# Altium schematic sheet Z7_POWER2.SchDoc
size A3
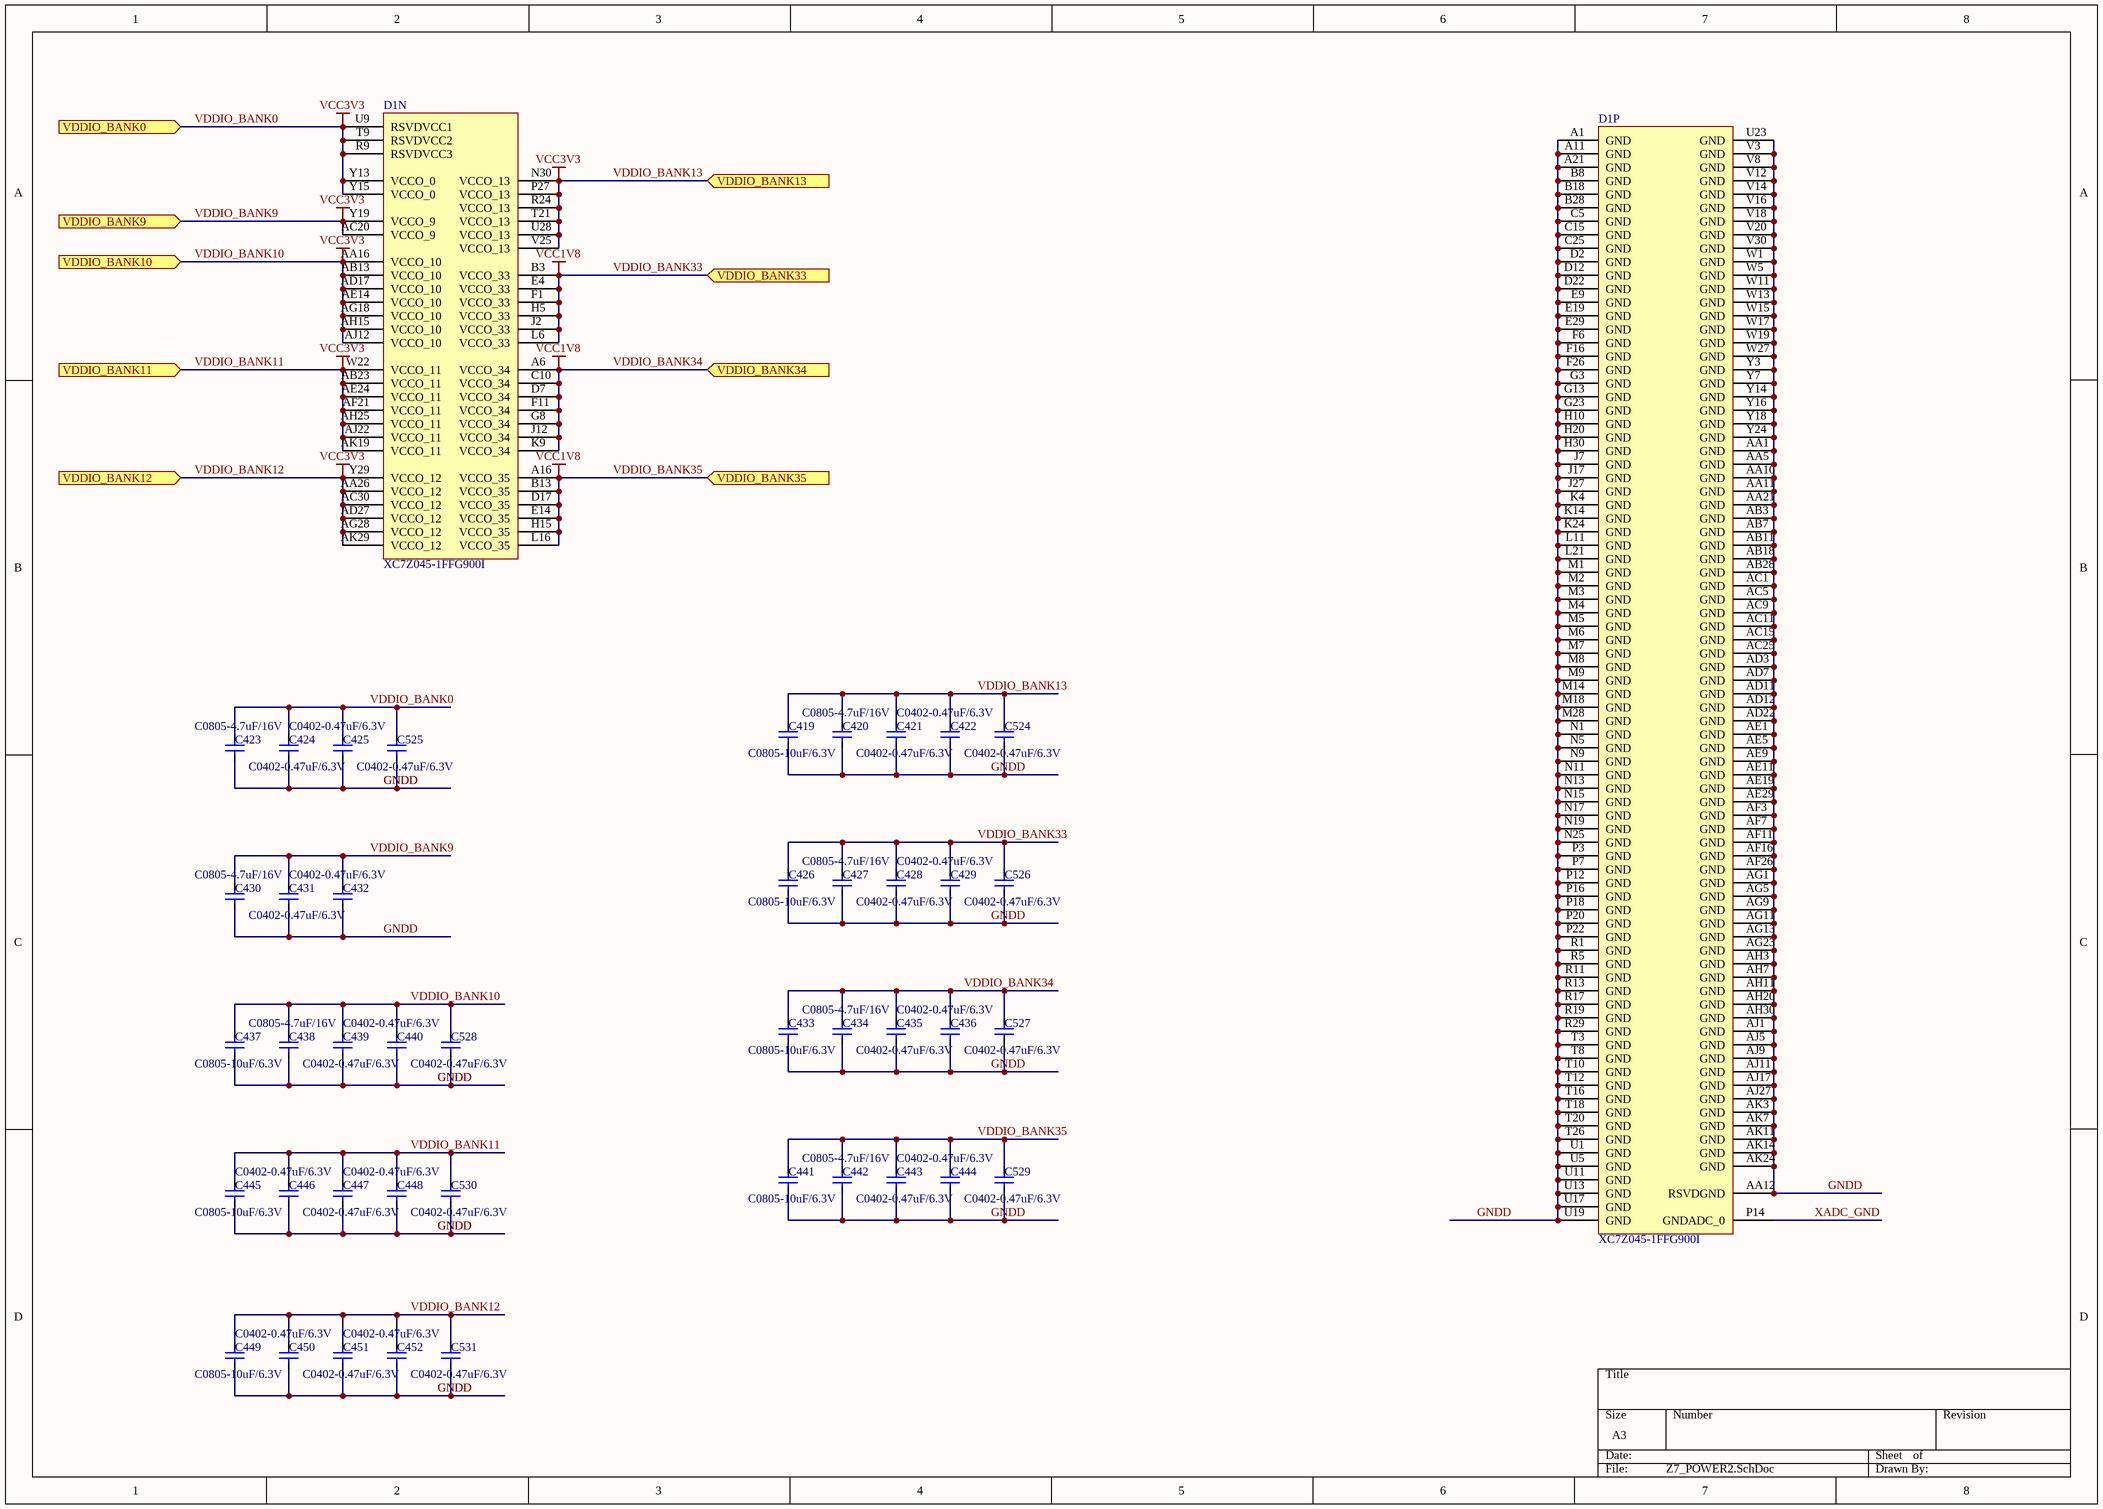
[diagram p0: Z7_POWER2.SchDoc]

## Parts
C419  C0805-10uF/6.3V  [C0805]
C420  C0805-4.7uF/16V  [C0805]
C421  C0402-0.47uF/6.3V  [C0402]
C422  C0402-0.47uF/6.3V  [C0402]
C423  C0805-4.7uF/16V  [C0805]
C424  C0402-0.47uF/6.3V  [C0402]
C425  C0402-0.47uF/6.3V  [C0402]
C426  C0805-10uF/6.3V  [C0805]
C427  C0805-4.7uF/16V  [C0805]
C428  C0402-0.47uF/6.3V  [C0402]
C429  C0402-0.47uF/6.3V  [C0402]
C430  C0805-4.7uF/16V  [C0805]
C431  C0402-0.47uF/6.3V  [C0402]
C432  C0402-0.47uF/6.3V  [C0402]
C433  C0805-10uF/6.3V  [C0805]
C434  C0805-4.7uF/16V  [C0805]
C435  C0402-0.47uF/6.3V  [C0402]
C436  C0402-0.47uF/6.3V  [C0402]
C437  C0805-10uF/6.3V  [C0805]
C438  C0805-4.7uF/16V  [C0805]
C439  C0402-0.47uF/6.3V  [C0402]
C440  C0402-0.47uF/6.3V  [C0402]
C441  C0805-10uF/6.3V  [C0805]
C442  C0805-4.7uF/16V  [C0805]
C443  C0402-0.47uF/6.3V  [C0402]
C444  C0402-0.47uF/6.3V  [C0402]
C445  C0805-10uF/6.3V  [C0805]
C446  C0402-0.47uF/6.3V  [C0402]
C447  C0402-0.47uF/6.3V  [C0402]
C448  C0402-0.47uF/6.3V  [C0402]
C449  C0805-10uF/6.3V  [C0805]
C450  C0402-0.47uF/6.3V  [C0402]
C451  C0402-0.47uF/6.3V  [C0402]
C452  C0402-0.47uF/6.3V  [C0402]
C524  C0402-0.47uF/6.3V  [C0402]
C525  C0402-0.47uF/6.3V  [C0402]
C526  C0402-0.47uF/6.3V  [C0402]
C527  C0402-0.47uF/6.3V  [C0402]
C528  C0402-0.47uF/6.3V  [C0402]
C529  C0402-0.47uF/6.3V  [C0402]
C530  C0402-0.47uF/6.3V  [C0402]
C531  C0402-0.47uF/6.3V  [C0402]
D1  XC7Z045-1FFG900I  [FFG900]  (parts N,P of 16)

## Ports
VDDIO_BANK0 (in), VDDIO_BANK9 (in), VDDIO_BANK10 (in), VDDIO_BANK11 (in), VDDIO_BANK12 (in), VDDIO_BANK13 (in), VDDIO_BANK33 (in), VDDIO_BANK34 (in), VDDIO_BANK35 (in)

## Nets
VDDIO_BANK0: C419.1 C420.1 C421.1 C422.1 C423.1 C424.1 C425.1 C430.1 C431.1 C432.1 C437.1 C438.1 C439.1 C440.1 C445.1 C446.1 C447.1 C448.1 C449.1 C450.1 C451.1 C452.1 C524.1 C525.1 C528.1 C530.1 C531.1 D1.AA16(VCCO_10) D1.AA26(VCCO_12) D1.AB13(VCCO_10) D1.AB23(VCCO_11) D1.AC20(VCCO_9) D1.AC30(VCCO_12) D1.AD17(VCCO_10) D1.AD27(VCCO_12) D1.AE14(VCCO_10) D1.AE24(VCCO_11) D1.AF21(VCCO_11) D1.AG18(VCCO_10) D1.AG28(VCCO_12) D1.AH15(VCCO_10) D1.AH25(VCCO_11) D1.AJ12(VCCO_10) D1.AJ22(VCCO_11) D1.AK19(VCCO_11) D1.AK29(VCCO_12) D1.N30(VCCO_13) D1.P27(VCCO_13) D1.R9(RSVDVCC3) D1.R24(VCCO_13) D1.T9(RSVDVCC2) D1.T21(VCCO_13) D1.U9(RSVDVCC1) D1.U28(VCCO_13) D1.V25(VCCO_13) D1.W22(VCCO_11) D1.Y13(VCCO_0) D1.Y15(VCCO_0) D1.Y19(VCCO_9) D1.Y29(VCCO_12) ; port VDDIO_BANK0, port VDDIO_BANK9, port VDDIO_BANK10, port VDDIO_BANK11, port VDDIO_BANK13, port VDDIO_BANK12  [also labelled VCC3V3, VDDIO_BANK10, VDDIO_BANK11, VDDIO_BANK12, VDDIO_BANK13, VDDIO_BANK9]
VDDIO_BANK33: C426.1 C427.1 C428.1 C429.1 C433.1 C434.1 C435.1 C436.1 C441.1 C442.1 C443.1 C444.1 C526.1 C527.1 C529.1 D1.A6(VCCO_34) D1.A16(VCCO_35) D1.B3(VCCO_33) D1.B13(VCCO_35) D1.C10(VCCO_34) D1.D7(VCCO_34) D1.D17(VCCO_35) D1.E4(VCCO_33) D1.E14(VCCO_35) D1.F1(VCCO_33) D1.F11(VCCO_34) D1.G8(VCCO_34) D1.H5(VCCO_33) D1.H15(VCCO_35) D1.J2(VCCO_33) D1.J12(VCCO_34) D1.K9(VCCO_34) D1.L6(VCCO_33) D1.L16(VCCO_35) ; port VDDIO_BANK33, port VDDIO_BANK34, port VDDIO_BANK35  [also labelled VCC1V8, VDDIO_BANK34, VDDIO_BANK35]
GNDD: C419.2 C420.2 C421.2 C422.2 C423.2 C424.2 C425.2 C426.2 C427.2 C428.2 C429.2 C430.2 C431.2 C432.2 C433.2 C434.2 C435.2 C436.2 C437.2 C438.2 C439.2 C440.2 C441.2 C442.2 C443.2 C444.2 C445.2 C446.2 C447.2 C448.2 C449.2 C450.2 C451.2 C452.2 C524.2 C525.2 C526.2 C527.2 C528.2 C529.2 C530.2 C531.2 D1.A1(GND) D1.A11(GND) D1.A21(GND) D1.AA1(GND) D1.AA5(GND) D1.AA10(GND) D1.AA11(GND) D1.AA12(RSVDGND) D1.AA21(GND) D1.AB3(GND) D1.AB7(GND) D1.AB11(GND) D1.AB18(GND) D1.AB28(GND) D1.AC1(GND) D1.AC5(GND) D1.AC9(GND) D1.AC11(GND) D1.AC15(GND) D1.AC25(GND) D1.AD3(GND) D1.AD7(GND) D1.AD11(GND) D1.AD12(GND) D1.AD22(GND) D1.AE1(GND) D1.AE5(GND) D1.AE9(GND) D1.AE11(GND) D1.AE19(GND) D1.AE29(GND) D1.AF3(GND) D1.AF7(GND) D1.AF11(GND) D1.AF16(GND) D1.AF26(GND) D1.AG1(GND) D1.AG5(GND) D1.AG9(GND) D1.AG11(GND) D1.AG13(GND) D1.AG23(GND) D1.AH3(GND) D1.AH7(GND) D1.AH11(GND) D1.AH20(GND) D1.AH30(GND) D1.AJ1(GND) D1.AJ5(GND) D1.AJ9(GND) D1.AJ11(GND) D1.AJ17(GND) D1.AJ27(GND) D1.AK3(GND) D1.AK7(GND) D1.AK11(GND) D1.AK14(GND) D1.AK24(GND) D1.B8(GND) D1.B18(GND) D1.B28(GND) D1.C5(GND) D1.C15(GND) D1.C25(GND) D1.D2(GND) D1.D12(GND) D1.D22(GND) D1.E9(GND) D1.E19(GND) D1.E29(GND) D1.F6(GND) D1.F16(GND) D1.F26(GND) D1.G3(GND) D1.G13(GND) D1.G23(GND) D1.H10(GND) D1.H20(GND) D1.H30(GND) D1.J7(GND) D1.J17(GND) D1.J27(GND) D1.K4(GND) D1.K14(GND) D1.K24(GND) D1.L11(GND) D1.L21(GND) D1.M1(GND) D1.M2(GND) D1.M3(GND) D1.M4(GND) D1.M5(GND) D1.M6(GND) D1.M7(GND) D1.M8(GND) D1.M9(GND) D1.M14(GND) D1.M18(GND) D1.M28(GND) D1.N1(GND) D1.N5(GND) D1.N9(GND) D1.N11(GND) D1.N13(GND) D1.N15(GND) D1.N17(GND) D1.N19(GND) D1.N25(GND) D1.P3(GND) D1.P7(GND) D1.P12(GND) D1.P16(GND) D1.P18(GND) D1.P20(GND) D1.P22(GND) D1.R1(GND) D1.R5(GND) D1.R11(GND) D1.R13(GND) D1.R17(GND) D1.R19(GND) D1.R29(GND) D1.T3(GND) D1.T8(GND) D1.T10(GND) D1.T12(GND) D1.T16(GND) D1.T18(GND) D1.T20(GND) D1.T26(GND) D1.U1(GND) D1.U5(GND) D1.U11(GND) D1.U13(GND) D1.U17(GND) D1.U19(GND) D1.U23(GND) D1.V3(GND) D1.V8(GND) D1.V12(GND) D1.V14(GND) D1.V16(GND) D1.V18(GND) D1.V20(GND) D1.V30(GND) D1.W1(GND) D1.W5(GND) D1.W11(GND) D1.W13(GND) D1.W15(GND) D1.W17(GND) D1.W19(GND) D1.W27(GND) D1.Y3(GND) D1.Y7(GND) D1.Y14(GND) D1.Y16(GND) D1.Y18(GND) D1.Y24(GND)
XADC_GND: D1.P14(GNDADC_0)

## Library data of the parts
C419 C426 C433 C437 C441 C445 C449 = C1210-22uF/16V: Part_number: C0805-10uF/6.3V; Part_type: CAP; Value: C0805-10uF/6.3V; Schematic_Part: CAP; PCB_Footprint: C0805
C420 C423 C427 C430 C434 C438 C442 = C0805-4.7uF/50V: X7R; Manufacturer: SAMSUNG; Part_number: C0805-4.7uF/16V; Part_type: CAP; Value: C0805-4.7uF/16V; Schematic_Part: CAP; PCB_Footprint: C0805; datasheet: #DataSheet\C_Samsung_General Capacitors.pdf#
C421 C422 C424 C425 C428 C429 C431 C432 C435 C436 C439 C440 C443 C444 C446-C448 C450-C452 C524-C531 = C0402-0.1uF/16V: X7R; Manufacturer: SAMSUNG; Manufacturer_p/n: CL05X7R104KO5NNN; Part_number: C0402-0.47uF/6.3V; Part_type: CAP; Value: C0402-0.47uF/6.3V; temperature: -55℃\+125℃; Schematic_Part: CAP; PCB_Footprint: C0402; datasheet: #DataSheet\C_Samsung_General Capacitors.pdf#
D1 = XC7Z045-1FFG900I: 667 MHz Zynq?7000 AP SoC, 130 PS I/O, 378 FPGA I/O, 900-Ball BGA, Speed Grade 1, Industrial Grade, Pb-Free; Manufacturer: Xilinx; Extensible Block RAM (# 36Kb Blocks): 2180 KB (545); Flip Flops: 437200; LUTs: 218600; Speed Grade: -1; DatasheetVersion: v1.2; PackageVersion: Rev 1.1; PackageReference: FFG900; PackageDescription: Flip-Chip BGA, Body 31 x 31 mm, 1.0 mm Pitch; Generic Part Number: XC7Z045; RoHS: Pb-Free; Mounting Technology: Surface Mount; Code_JEDEC: MS-034-AAN-1; PartNumber: XC7Z045-1FFG900I; ComponentLink1Description: Datasheet; ComponentLink1URL: http://www.xilinx.com/support/documentation/data_sheets/ds190-Zynq-7000-Overview.pdf; ComponentLink2Description: Package Specification; ComponentLink2URL: http://www.xilinx.com/support/documentation/user_guides/ug865-Zynq-7000-Pkg-Pinout.pdf; ComponentLink3Description: DC and AC Switching Characteristics; ComponentLink3URL: http://www.xilinx.com/support/documentation/data_sheets/ds191-XC7Z030-XC7Z045-data-sheet.pdf; ComponentLink4Description: Package File; ComponentLink4URL: http://www.xilinx.com/support/packagefiles/z7packages/xc7z045ffg900pkg.txt; ComponentLink5Description: Packaging and Pinout; ComponentLink5URL: http://www.xilinx.com/support/documentation/user_guides/ug865-Zynq-7000-Pkg-Pinout.pdf; ComponentLink6Description: PCB and Layout Guide; ComponentLink6URL: http://www.xilinx.com/support/documentation/user_guides/ug483_7Series_PCB.pdf